# Altium schematic sheet Schematic.SchDoc
size A3; SheetNumber: 1; SheetTotal: 1
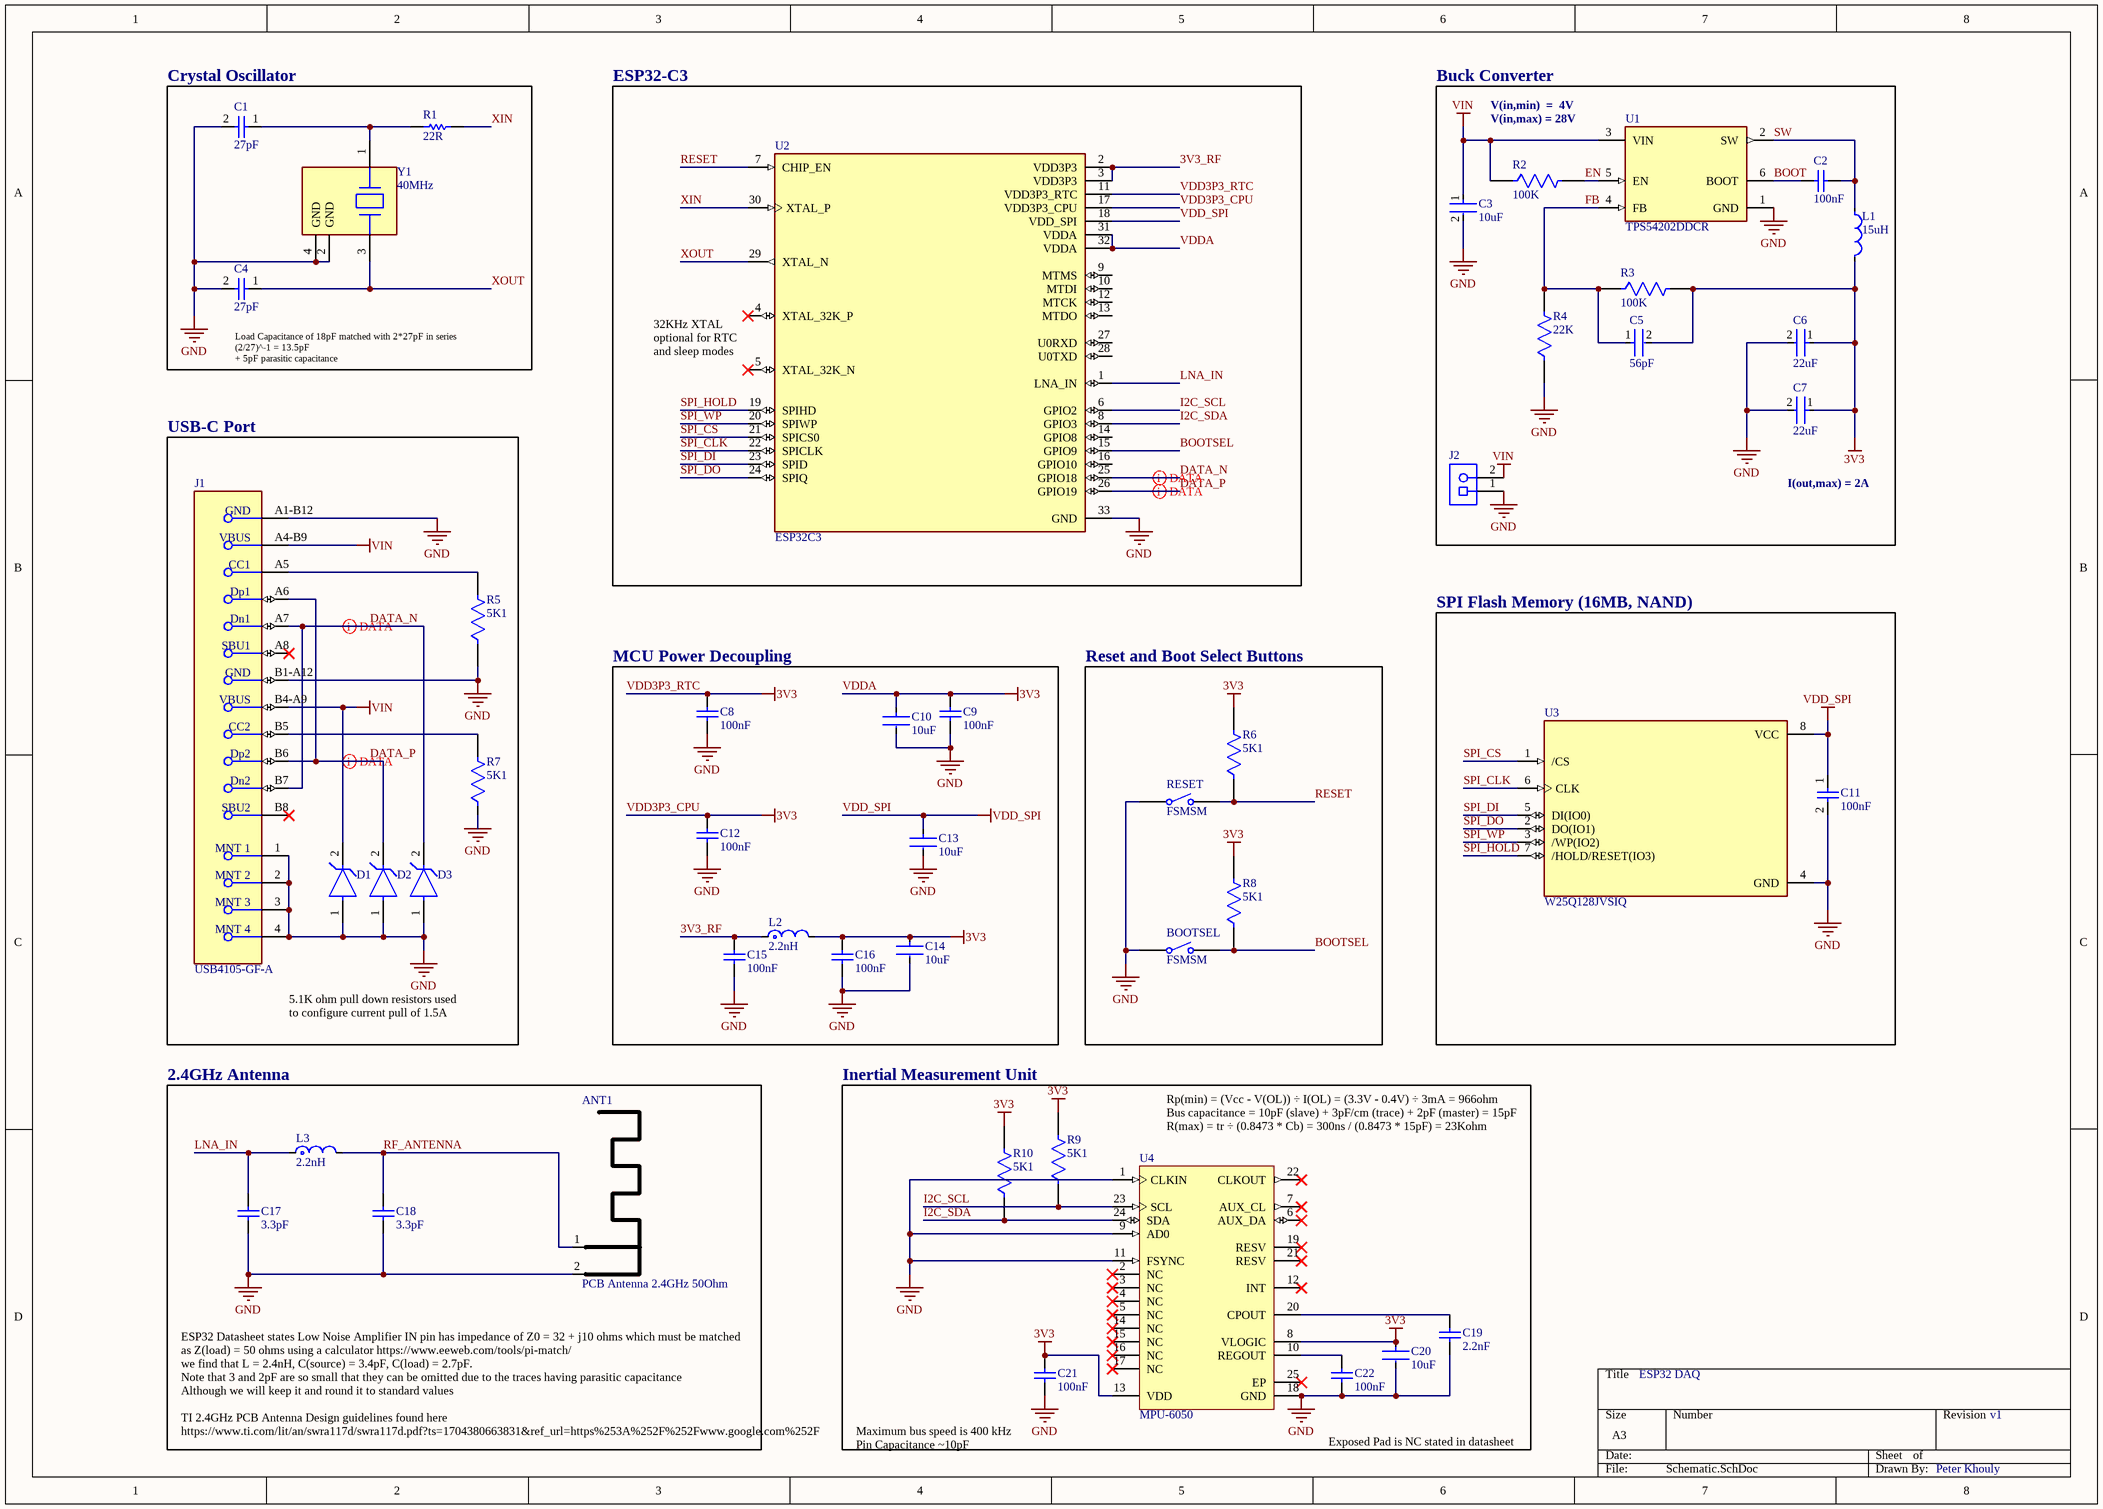
[diagram p0: Schematic.SchDoc]

## Parts
ANT1  PCB Antenna 2.4GHz 50Ohm  [ANT_IFA_USB_2_4GHZ_50R]  (no BOM)
BOOTSEL  FSMSM  [TECO-FSMSM-2_V]
C1  27pF  [CAPC1005X55X25LL05T10]
C2  100nF  [CAPC1005X56X25LL10T15]
C3  10uF  [FP-GRM15-0_2-MFG]
C4  27pF  [CAPC1005X55X25LL05T10]
C5  56pF  [FP-0402-L_1_0_1-W_0_5_0_1-MFG]
C6  22uF  [FP-CL746-IPC_C]
C7  22uF  [FP-CL746-IPC_C]
C8  100nF  [CAPC1005X56X25LL10T15]
C9  100nF  [CAPC1005X56X25LL10T15]
C10  10uF  [FP-GRM15-0_2-MFG]
C11  100nF  [CAPC1005X56X25LL10T15]
C12  100nF  [CAPC1005X56X25LL10T15]
C13  10uF  [FP-GRM15-0_2-MFG]
C14  10uF  [FP-GRM15-0_2-MFG]
C15  100nF  [CAPC1005X56X25LL10T15]
C16  100nF  [CAPC1005X56X25LL10T15]
C17  3.3pF  [CAPC1005X55X25NL5T10]
C18  3.3pF  [CAPC1005X55X25NL5T10]
C19  2.2nF  [CAPC1005X56X25LL10T15]
C20  10uF  [FP-GRM15-0_2-MFG]
C21  100nF  [CAPC1005X56X25LL10T15]
C22  100nF  [CAPC1005X56X25LL10T15]
D1  (no value)  [FP-SLP1006P2-MFG]
D2  (no value)  [FP-SLP1006P2-MFG]
D3  (no value)  [FP-SLP1006P2-MFG]
J1  USB4105-GF-A  [FP-USB4105-GF-A-MFG]
J2  (no value)  [PHOE-1729128-2_V]
L1  15uH  [FP-MLZ2012-1_25-IPC_B]
L2  2.2nH  [FP-LQG15HH_02-IPC_C]
L3  2.2nH  [FP-LQG15HH_02-IPC_C]
R1  22R  [RESC1005X40X25ML05T05]
R2  100K  [FP-ERJ2RK-IPC_C]
R3  100K  [FP-ERJ2RK-IPC_C]
R4  22K  [FP-ERJ2RK-MFG]
R5  5K1  [FP-ERJ2RK-IPC_A]
R6  5K1  [FP-ERJ2RK-IPC_A]
R7  5K1  [FP-ERJ2RK-IPC_A]
R8  5K1  [FP-ERJ2RK-IPC_A]
R9  5K1  [FP-ERJ2RK-IPC_A]
R10  5K1  [FP-ERJ2RK-IPC_A]
RESET  FSMSM  [TECO-FSMSM-2_V]
U1  TPS54202DDCR  [FP-DDC0006A-IPC_B]
U2  ESP32C3  [QFN32_5X5MM]
U3  W25Q128JVSIQ  [SOIC127P790X216-8N]
U4  MPU-6050  [IS-QFN-24_V]
Y1  40MHz  [FP-ABM3B-MFG]

## Blocks framed on the sheet
Crystal Oscillator: C1 C4 R1 Y1
ESP32-C3: U2
Buck Converter: C2 C3 C5-C7 J2 L1 R2-R4 U1
USB-C Port: D1-D3 J1 R5 R7
MCU Power Decoupling: C8-C10 C12-C16 L2
Reset and Boot Select Buttons: BOOTSEL R6 R8 RESET
SPI Flash Memory (16MB, NAND): C11 U3
2.4GHz Antenna: ANT1 C17 C18 L3
Inertial Measurement Unit: C19-C22 R9 R10 U4

## Nets
GND: ANT1.2(GND) BOOTSEL.1 C1.2 C3.2 C4.2 C6.2 C7.2 C8.2 C9.2 C10.2 C11.2 C12.2 C13.2 C14.2 C15.2 C16.2 C17.1 C18.1 C19.2 C20.2 C21.2 C22.2 D1.1(A) D2.1(A) D3.1(A) J1.1(MNT_1) J1.2(MNT_2) J1.3(MNT_3) J1.4(MNT_4) J1.A1-B12(GND) J1.B1-A12(GND) J2.1 R4.1 R5.1 R7.1 RESET.1 U1.1(GND) U2.33(GND) U3.4(GND) U4.1(CLKIN) U4.9(AD0) U4.11(FSYNC) U4.18(GND) Y1.2(GND) Y1.4(GND)
VDD3P3_CPU: C5.2 C6.1 C7.1 C8.1 C9.1 C10.1 C12.1 C14.1 C16.1 C20.1 C21.1 L1.2 L2.2 R3.2 R6.2 R8.2 R9.2 R10.2 U2.11(VDD3P3_RTC) U2.17(VDD3P3_CPU) U2.31(VDDA) U2.32(VDDA) U4.8(VLOGIC) U4.13(VDD)  [also labelled 3V3, VDD3P3_RTC, VDDA]
VDD_SPI: C11.1 C13.1 U2.18(VDD_SPI) U3.8(VCC)
VIN: C3.1 D1.2(C) J1.A4-B9(VBUS) J1.B4-A9(VBUS) J2.2 R2.1 U1.3(VIN)
3V3_RF: C15.1 L2.1 U2.2(VDD3P3) U2.3(VDD3P3)
BOOT: C2.2 U1.6(BOOT)
BOOTSEL: BOOTSEL.2 R8.1 U2.15(GPIO9)
DATA_N: D3.2(C) J1.A7(Dn1) J1.B7(Dn2) U2.25(GPIO18)
DATA_P: D2.2(C) J1.A6(Dp1) J1.B6(Dp2) U2.26(GPIO19)
EN: R2.2 U1.5(EN)
FB: C5.1 R3.1 R4.2 U1.4(FB)
I2C_SCL: R9.1 U2.6(GPIO2) U4.23(SCL)
I2C_SDA: R10.1 U2.8(GPIO3) U4.24(SDA)
LNA_IN: C17.2 L3.1 U2.1(LNA_IN)
RESET: R6.1 RESET.2 U2.7(CHIP_EN)
RF_ANTENNA: ANT1.1(RF) C18.2 L3.2
SPI_CLK: U2.22(SPICLK) U3.6(CLK)
SPI_CS: U2.21(SPICS0) U3.1(/CS)
SPI_DI: U2.23(SPID) U3.5(DI(IO0))
SPI_DO: U2.24(SPIQ) U3.2(DO(IO1))
SPI_HOLD: U2.19(SPIHD) U3.7(/HOLD/RESET(IO3))
SPI_WP: U2.20(SPIWP) U3.3(/WP(IO2))
SW: C2.1 L1.1 U1.2(SW)
XIN: R1.2 U2.30(XTAL_P)
XOUT: C4.1 U2.29(XTAL_N) Y1.3
NetC1_1: C1.1 R1.1 Y1.1
NetC19_1: C19.1 U4.20(CPOUT)
NetC22_1: C22.1 U4.10(REGOUT)
NetJ1_A5: J1.A5(CC1) R5.2
NetJ1_B5: J1.B5(CC2) R7.2

Not connected (* = marked no-connect by the designer): J1 A8(SBU1)* B8(SBU2)*; U2 4(XTAL_32K_P)* 5(XTAL_32K_N)* 9(MTMS) 10(MTDI) 12(MTCK) 13(MTDO) 14(GPIO8) 16(GPIO10) 27(U0RXD) 28(U0TXD); U4 2(NC)* 3(NC)* 4(NC)* 5(NC)* 6(AUX_DA)* 7(AUX_CL)* 12(INT)* 14(NC)* 15(NC)* 16(NC)* 17(NC)* 19(RESV)* 21(RESV)* 22(CLKOUT)* 25(EP)*

## Layout directives
differential pair; differential pair class DATA: DATA_N, DATA_P

## Notes on the sheet
- V(in,min)  =  4V
- V(in,max) = 28V
- (near C4) Load Capacitance of 18pF matched with 2*27pF in series
  (2/27)^-1 = 13.5pF
  + 5pF parasitic capacitance
- (near U2) 32KHz XTAL optional for RTC and sleep modes
- I(out,max) = 2A
- 5.1K ohm pull down resistors used to configure current pull of 1.5A
- (near U4) Rp(min) = (Vcc - V(OL)) ÷ I(OL) = (3.3V - 0.4V) ÷ 3mA = 966ohm
  Bus capacitance = 10pF (slave) + 3pF/cm (trace) + 2pF (master) = 15pF
  R(max) = tr ÷ (0.8473 * Cb) = 300ns / (0.8473 * 15pF) = 23Kohm
- ESP32 DAQ
- ESP32 Datasheet states Low Noise Amplifier IN pin has impedance of Z0 = 32 + j10 ohms which must be matched as Z(load) = 50 ohms using a calculator https://www.eeweb.com/tools/pi-match/
  we find that L = 2.4nH, C(source) = 3.4pF, C(load) = 2.7pF.
  Note that 3 and 2pF are so small that they can be omitted due to the traces having parasitic capacitance
  Although we will keep it and round it to standard values
  TI 2.4GHz PCB Antenna Design guidelines found here
  https://www.ti.com/lit/an/swra117d/swra117d.pdf?ts=1704380663831&ref_url=https%253A%252F%252Fwww.google.com%252F
- Maximum bus speed is 400 kHz
  Pin Capacitance ~10pF
- Exposed Pad is NC stated in datasheet
- v1
- Peter Khouly

## Library data of the parts
ANT1 = ANT_IFA_USB_2_4GHZ_50R: Inverted F 2.4GHz ISM PCB Antenna 50 Ohm; ComponentLink1Description: Datasheet; ComponentLink1URL: https://www.ti.com/lit/an/swra117d/swra117d.pdf
BOOTSEL RESET = CMP-2000-07511-1: FSMSM Push Button Switch, 50 mA, -35 to 85 degC, 2-Pin SMD, RoHS, Bulk; Manufacturer: TE Connectivity; Actuator Length: 1.07mm; Electrical Life: 20000Cycles; Actuator Material: Polyamide; Current Rating: 50mA; Illumination Type: Illuminated; Voltage Rating (DC): 24V; Contact Resistance: 100mOhm; Case\/Package: SMD/SMT; Operating Force: 180gf; Switch Travel: 0.25mm; Max Voltage Rating (DC): 12V; Throw Configuration: SPST; Packaging: LoosePiece; Max Operating Temperature: 85degC; ELV: Compliant; Package Description: 2-Pin Surface Mount Device, Body 6 x 3.5 mm, Pitch 9.19 mm; RoHSCompliant: true; Manufacturer URL: http://www.te.com/; Contact Plating: Silver; Contact Material: Brass; Mounting Technology: SurfaceMount; Contact Current Rating: 50mA; Datasheet Version: Rev. C2, 08/2014; Datasheet URL: http://www.te.com/commerce/DocumentDelivery/DDEController?Action=showdoc&DocId=Customer+Drawing%7F1437566-3%7FC2%7Fpdf%7FEnglish%7FENG_CD_1437566-3_C2_1437566_3_1_c.dwg.pdf%7F1437566-3; Mechanical Life: 20000Cycles; Package Reference: FSMSM; REACH SVHC: Unknown; Orientation: Straight; Min Operating Temperature: -35degC; Lead Free: LeadFree; Termination: GullWing; Package Quantity: 1000; Mount: SurfaceMount
C1 C4 = CMP-2008-03917-1: Part Number: GRM1555C1H270JA01D; Manufacturer: Murata
C2 C8 C9 C11 C12 C15 C16 C21 C22 = CMP-2008-02743-1: Manufacturer: AVX Interconnect / Elco; Part Number: 04026D104KAT2A
C3 C10 C13 C14 C20 = CMP-06035-000074-1: CAP CER 10UF 6.3V X6S 0402; Manufacturer Part Number: GRM155C80J106ME11D; Manufacturer: Murata; Tolerance: 20%; Material: Ceramic; Temperature Coefficient: 22%; ComponentLink2Description: Datasheet; Temperature Characteristic: X6S; RoHS: TRUE; Value: 10uF; Temperature: -55°C to +105°C; Device Class L2: Capacitors; Height: 0.7mm; Category: Cap; Device Class L1: Passive Components; Temperature Range Low: -55°C; Automotive: No; Mouser Description: Cap Ceramic 10uF 6.3V X6S 20% Pad SMD 0402 105C T/R; ComponentLink2URL: https://search.murata.co.jp/Ceramy/image/img/A01X/G101/ENG/GRM155C80J106ME11-01.pdf; Voltage Rating: 6.3V; Ipc Land Pattern Name: CAPC10050X50; Lead Free: Yes; Octopart: https://octopart.com/grm155c80j106me11d-murata-71220993; Digikey Description: CAP CER 10UF 6.3V X6S 0402; Temperature Range High: +105°C; Capacitance: 10uF; Package: GRM15-0.2; Device Class L3: Ceramic Capacitors
C5 = CMP-2008-02663-2: General Purpose Ceramic Capacitor, 0402, 56pF, 5%, C0G, 30ppm/°C, 50V; Package Quantity: 1; Dielectric: C0G; Dielectric Material: Ceramic; REACH SVHC: No SVHC; Capacitance: 56pF; Case Code (Imperial): 0402; Max Operating Temperature: 125°C; Voltage Rating: 50V; Contact Plating: Tin; Thickness: 0.022inch; Number of Pins: 2; Length: 1mm; Voltage Rating (DC): 50V; Tolerance: 5%; Case/Package: 0402; Construction: Flat; RoHS Compliant: Yes; Case Code (Metric): 1005; Width: 0.02inch; Series: -; Voltage: 50V; Packaging: Tape and Reel; Radiation Hardening: No; Depth: 0.5mm; Lead Free: Lead Free; Mount: Surface Mount; Termination: SMD/SMT; Height: 0.5mm; Temperature Coefficient: 0ppm/°C; Min Operating Temperature: -55°C
C6 C7 = CMP-13271-000286-1: Cap Ceramic 22uF 6.3V X5R ±20% SMD 0402 +85°C Paper T/R; Case Code (Imperial): 0402; Tolerance: 20%; Width: 0.02inch; Packaging: Tape and Reel; Case/Package: 0402; Min Operating Temperature: -55°C; Max Operating Temperature: 85°C; Voltage Rating: 6.3V; Capacitance: 22uF; Thickness: 0.022inch; Mount: Surface Mount; Length: 0.039inch; Case Code (Metric): 1005
C17 C18 = CMP-1034-00264-3: Chip Capacitor, 3.3 pF, +/- 0.25 pF, 50 V, -55 to 125 degC, 0402 (1005 Metric), RoHS, Tape and Reel; PartNumber: GRM1555C1H3R3CA01D; Type (Capacitors): C0G; Voltage Rating: 50 V; Package Quantity: 10000; Mounting Technology: Surface Mount; Case Code (Metric): 1005; ComponentLink1Description: Manufacturer URL; PackageDescription: 2-Pin Surface Mount Device, Body 1 x 0.5 mm; Length: 0.039 inch; RoHSCompliant: true; ComponentLink1URL: http://www.murata.com/; Height: 0.5 mm; Max Operating Temperature: 125 degC; REACH SVHC: No SVHC; ComponentLink2URL: http://search.murata.co.jp/Ceramy/image/img/A01X/G101/ENG/GRM1555C1H3R3CA01-01.pdf; Width: 0.02 inch; Capacitance: 3.3 pF; Mount: Surface Mount; Min Operating Temperature: -55 degC; Case Code (Imperial): 0402; Case/Package: 0402; Radiation Hardening: No; Voltage Rating (DC): 50 V; ComponentLink2Description: Datasheet; Packaging: Tape and Reel; DatasheetVersion: 03/2016
C19 = CMP-2008-02907-1: Manufacturer: AVX Interconnect / Elco; Part Number: 04025C222JAT2A
D1-D3 = CMP-56445-000005-1: TVS DIODE 33VWM 60VC SLP1006P2; Direction: Unidirectional; Min Breakdown Voltage: 36V; Leakage Current: 1uA; Peak Pulse Power: 125W; Power Line Protection: No; Number of Unidirectional Channels: 1; Clamping Voltage: 60V; Peak Pulse Current: 2A; Power Dissipation: 170W; Diode Type: ZENER; Element Configuration: Single; Reverse Standoff Voltage: 33V; Max Breakdown Voltage: 45V; Max Operating Temperature: 125°C; Resistor Type: Zener; Series: Automotive, AEC-Q100, uClamp®; Min Operating Temperature: -40°C; Case Code (Imperial): 0402; Number of Pins: 2; Lead Free: Lead Free; Case/Package: SMD/SMT; RoHS Compliant: Yes; Packaging: Tape and Reel; Clamping Voltage-Max: 60V; Depth: 0.6mm; Case Code (Metric): 1006; Length: 1mm; Radiation Hardening: No; Mount: Surface Mount; Working Voltage: 33V
J1 = CMP-245163-000001-1: CONN RCPT USB2.0 TYPEC 5A; Manufacturer: GCT; Voltage Rating: 20V; Is Female: yes; Current Rating: 5/6.25/1.25/0.25A; Number Of Contacts: 16; Conn Orientation: Right Angle; Device Class L1: Connectors; Category: Conn; Lead Free: Yes; RoHS: TRUE; Temperature Range High: +85°C; Digikey Description: CONN RCPT USB2.0 TYPEC 5A; Device Class L3: unset; ComponentLink2Description: Datasheet; Manufacturer Part Number: USB4105-GF-A; Package: 0; Usb Standard: USB 2.0; Device Class L2: USB Connectors; Automotive: No; Temperature Range Low: -40°C; Height: 3.46mm; Temperature: -40°C to +85°C; Contact Material: Gold,Nickel; ComponentLink2URL: https://gct.co/files/drawings/usb4105.pdf; Octopart: https://octopart.com/usb4105-gf-a-gct-106627878
J2 = CMP-2000-05815-1: PCB Terminal Block, 13.5 A, 400 V, 2-Pin THD, RoHS, Bulk; PartNumber: 1729128; Manufacturer: Phoenix Contact; Package Version: 03/2015; No. of Rows: 1; Pitch: 5.08mm; No. of Positions: 2; Voltage Rating: 400V; Current Rating: 13500mA; Manufacturer URL: http://www.phoenixcontact.com/; Datasheet URL: https://datasheet.ciiva.com/16046/1729128-16046181.pdf; RoHS: TRUE; Package URL: https://www.phoenixcontact.com/online/portal/pi/pxc/product_detail_page/!ut/p/b1/3VdJjqNKFDxLH8AFycySyWY2ozFsEPOMMQaDOX1XedGL_1Vdm5YXJleknhSKeBkvI6EA8ncAo3AYoDhBQGco6KN7VURTdemj9us_IEKEZo_YHiPAEWEFmDGOHMORkqKYCORBZxgL7ZoaZYcbFFUZ3fqxSY6GOuxydWUuHqz1ynmMFygu583Bob0Ewr6Sd_l-5m-kAueHiB0jpRwZwe58wwtkpxtMYd_LmGcDRU02dRNEyWt6Y2ti5pSyJ_reIkzIulrqApdnbT11V5jnCKbYNCvhEM1MCpPByat_X379-iThf08CI5GfOPqfBeS3BRoBOdD55AKVv0iLwCMq-2BrzXWSGRH7pUGD9uwXQjiph3xL0DKQwdGa0JImiIOmBNOestqgwTHSSs2oOep-78apyXQBvNi8ZLaFjvjWvcaUEBu0MC6Wbe-d6mB0FAebo2lUWinqYaZs5DAYzV0RP9yitUjnGJ0iI9xhZkT42OCQNUJJhkgWINNQLP2JFP6OpMg3JCVg70jqHT0lvKOnhHf0lPuOnnLf0VPuWx6_dxwUIvwk5WMkT0kLL1mh61l2yZVSzG3pYV_bqo-mj6uMKwKwdnnW8Jh5RTOJzMOA5c-eJDaZQw4mTMPH02PvS_ZAqNVjVTo2WyYLkwH_KU1mmmG5kjRhDqPXLwwVHvVOjCM60-fpXvTDfMGW1PVFVS1r4e4yVDk4ZdNbkUHvqPqQSeian4UD39fNKmachqdJ1NJbyk8rXT9mXTvPk3oE5meulKGgiruPJek-4I9hTT6G8ZLOyRSm2RRVbThERQad5OS28hdt4YW4vG0stgYYzsWsK4_7y6DZMjJSCqri1kyiZR5vD7pwIrNR7QwPHTcLTI5qT7eRlpHrdGiupYlqQDJ7zy_CND8fWWBoLRXxk1RVcXiBQwbTD4Xi7KL-FuO94t9xaqweXzH; Package Description: 2-Pin Through Hole Device, Body 8.1 x 10.16 mm, Pitch 5.08 mm; Datasheet Version: 12/2013; Mounting Technology: ThroughHole; Orientation: Horizontal; Package Reference: 1729128-2; Packing: Bulk
L1 = CMP-08253-000108-1: Shielded Multilayer Inductor 15uH ±20% 350mA 611mΩ SMD 0805; Core Material: Ferrite; DC Resistance (DCR): 611mR; Test Frequency: 2MHz; Saturation Current: 90mA; Self Resonant Frequency: 40MHz; Mount: Surface Mount; Height - Seated (Max): 0.057inch; Case/Package: 0805; Case Code (Imperial): 0805; Width: 0.049inch; Current Rating: 350mA; Case Code (Metric): 2012; Max Operating Temperature: 125°C; Packaging: Tape and Reel; Length: 0.079inch; Inductance: 15uH; Shielding: Shielded; RoHS Compliant: Yes; Min Operating Temperature: -55°C; Tolerance: 20%; Package Quantity: 1
L2 L3 = CMP-1662-00024-2: Multilayer type RF Inductor 2.2nH ±0.3nH 0.09Ω 900mA 0402; Test Frequency: 100MHz; Core Material: Air; DC Resistance (DCR): 150mR; Q Factor: 8; Shielding: Unshielded; Self Resonant Frequency: 6GHz; Current Rating: 300mA; Lead Free: Lead Free; Military Standard: Not; Case Code (Imperial): 0402; Case Code (Metric): 1005; Min Operating Temperature: -55°C; Width: 0.02inch; Depth: 0.55mm; Length: 1mm; REACH SVHC: No SVHC; Height - Seated (Max): 0.022inch; Case/Package: 0402; Inductance: 2.2nH; Height: 0.02inch; Package Quantity: 10000; Packaging: Tape and Reel; Mount: Surface Mount; Max DC Current: 300mA; Number of Pins: 2; Max Operating Temperature: 125°C; Termination: SMD/SMT; DC Current: 300mA; Radiation Hardening: No
R1 = CMP-2002-01135-4: Chip Resistor, 22 Ohm, +/- 1%, 0.1 W, -55 to 155 degC, 0402 (1005 Metric), RoHS, Tape and Reel; PartNumber: ERJ-2RKF22R0X; Case\/Package: 0402; Resistance: 22 Ohm; Power Rating: 100 mW; Voltage Rating: 50 V; ComponentLink2Description: Datasheet; Packaging: Tape and Reel; Weight: 2.8E-05oz; Pins: 2; Case Code (Imperial): 0402; Width: 0.5 mm; ComponentLink2URL: http://industrial.panasonic.com/cdbs/www-data/pdf/RDA0000/AOA0000C86.pdf; Height: 0.35 mm; PackageReference: 0402; REACH SVHC: Yes; Min Operating Temperature: -55 degC; Length: 1 mm; DatasheetVersion: 04/2015; RoHSCompliant: true; Package Quantity: 10000; Case Code (Metric): 1005; PackageDescription: 2-Pin Surface Mount Device, Body 1 x 0.5 mm; ComponentLink1URL: http://www.panasonic.com/; Mount: Surface Mount; Mounting Technology: Surface Mount; Tolerance: 1%; Max Operating Temperature: 155 degC; ComponentLink1Description: Manufacturer URL
R2 R3 = CMP-2002-00608-4: RES SMD 100K OHM 1% 1/10W 0402; Resistance: 100kR; Voltage Rating (DC): 50V; Power Rating: 100mW; Temperature Coefficient: 100ppm/°C; Case/Package: 0402; Length: 1mm; Package Quantity: 1; Radiation Hardening: No; Case Code (Metric): 1005; Contact Plating: Tin; Mount: Surface Mount; Depth: 0.5mm; Max Operating Temperature: 155°C; Lead Free: Lead Free; Width: 0.5mm; Composition: Thick Film; Case Code (Imperial): 0402; Tolerance: 1%; Termination: SMD/SMT; Number of Pins: 2; Height: 0.35mm; Voltage Rating: 50V; Military Standard: Not; REACH SVHC: No SVHC; Packaging: Tape and Reel; Min Operating Temperature: -55°C; Max Power Dissipation: 100mW; Features: Automotive AEC-Q200; Number of Terminations: 2
R4 = CMP-2002-01133-2: RES SMD 22K OHM 1% 1/10W 0402; Resistance: 22kR; Max Power Dissipation: 100mW; Voltage Rating (DC): 50V; Temperature Coefficient: 100ppm/°C; Case Code (Imperial): 0402; Military Standard: Not; Case Code (Metric): 1005; Termination: SMD/SMT; Tolerance: 1%; Width: 0.02inch; Number of Terminations: 2; Packaging: Tape and Reel; Voltage Rating: 50V; Radiation Hardening: No; REACH SVHC: No SVHC; Contact Plating: Tin; Lead Free: Lead Free; Case/Package: 0402; Power Rating: 100mW; Depth: 0.5mm; Length: 1mm; Number of Pins: 2; Max Operating Temperature: 155°C; Composition: Thick Film; Height: 0.35mm; Min Operating Temperature: -55°C; Mount: Surface Mount; Package Quantity: 10000
R5-R10 = CMP-2002-01158-2: RES SMD 5.1K OHM 1% 1/10W 0402; Voltage Rating: 50V; Temperature Coefficient: 100ppm/°C; Resistance: 5.1kR; Power Rating: 100mW; Min Operating Temperature: -55°C; Technology: THICK FILM; Military Standard: Not; Depth: 0.5mm; Contact Plating: Tin; Tolerance: 1%; Construction: Rectangular; Length: 1mm; Case/Package: 0402; Lead Free: Lead Free; RoHS Compliant: Yes; Termination: SMD/SMT; Height: 0.35mm; Max Operating Temperature: 155°C; Case Code (Imperial): 0402; Number of Terminations: 2; Packaging: Tape and Reel; Case Code (Metric): 1005; Width: 0.5mm; Max Power Dissipation: 100mW; Package Quantity: 10000; Resistance Tolerance: 1%; REACH SVHC: No SVHC; Mount: Surface Mount; Series: ERJ; Voltage Rating (DC): 50V; Weight: 2.8E-05oz; Resistor Type: Thick Film
U1 = CMP-04918-000439-1: IC REG BUCK ADJ 2A TSOT23-6; Switching Frequency: 500kHz; Quiescent Current: 40uA; Max Output Voltage: 28V; Output Configuration: Positive; Min Output Voltage: 596mV; Min Input Voltage: 4.5V; Synchronous Rectifier: Yes; Output Type: Adjustable; Number of Outputs: 1; Packaging: Tape and Reel; Case/Package: SOT-23-6; RoHS Compliant: Yes; Max Input Voltage: 28V; Max Operating Temperature: 125°C; Min Operating Temperature: -40°C; Output Current: 2A; Lead Free: Lead Free; Mount: Surface Mount
U2 = ESP32C3: WiFi Modules (802.11) (Engineering Samples Only) SMD IC ESP32-C3, RISC-V single-core MCU, 2.4G Wi-Fi & BLE 5.0 combo, QFN 32-pin, 5*5 mm, 40 ~ 105C; MF: Espressif Systems; SnapEDA_Link: https://www.snapeda.com/parts/ESP32-C3/Espressif+Systems/view-part/?ref=snap; Package: VFQFN-32 Espressif Systems; Value: *; MP: ESP32-C3; Check_prices: https://www.snapeda.com/parts/ESP32-C3/Espressif+Systems/view-part/?ref=eda
U3 = W25Q128JVSIQ: FLASH - NOR Memory IC 128Mb (16M x 8) SPI - Quad I/O, QPI, DTR 133 MHz 8-SOIC; MF: Winbond Electronics; Price: None; Purchase-URL: https://pricing.snapeda.com/search/part/W25Q128JVSIQ/?ref=eda; Check_prices: https://www.snapeda.com/parts/W25Q128JVSIQ/Winbond+Electronics/view-part/?ref=eda; Value: *; MP: W25Q128JVSIQ; Package: SOIC-8 Winbond; SnapEDA_Link: https://www.snapeda.com/parts/W25Q128JVSIQ/Winbond+Electronics/view-part/?ref=snap; Availability: In Stock
U4 = CMP-1753-00002-2: 3-Axis Gyroscope, Accelerometer and a Digital Motion Processor(TM) (DMP), 2.375 to 3.46 V, -40 to 85 degC, 24-Pin QFN, RoHS, Tape and Reel; Manufacturer: InvenSense; Featured Product: MPU-60506-Axis,IntegratedI²CSolution; Other Names: 1428-1007-2 / MPU6050; Sensor Type: MotionTracking; Online Catalog: MPU-6000™Series; Unit PriceUSD: Digital; Datasheet Version: Rev. 3.3, 05/2012; Category: Sensors,Transducers; Datasheet URL: http://datasheet.octopart.com/MPU-6050-InvenSense-datasheet-14421344.pdf; Family: Multifunction; Standard Package: 5,000; Manufacturer URL: http://www.invensense.com/; Output Type: Digital; Dynamic Catalog: MPU-6000™Series
Y1 = CMP-1688-00006-2: Crystal 40MHz ±20ppm 18pF SMD-4 5mm x 3.2mm; ESR (Equivalent Series Resistance): 50R; Frequency Stability: 50ppm; Max Operating Temperature: 70°C; Operating Frequency: 40 MHz; Length: 0.197inch; Packaging: Tape and Reel; Height: 0.043inch; Load Capacitance: 18pF; Number of Pins: 4; Package Quantity: 1000; Series: ABM3B; Min Operating Temperature: -20°C; Width: 0.126inch; Resistor Type: Ceramic; Frequency: 40MHz; Case/Package: SMD/SMT; Lead Free: Lead Free; Tolerance: 20ppm; Frequency Tolerance: 20ppm; Mount: Surface Mount; Termination: SMD/SMT